# EAGLE design Mainboard (EAGLE 7.7.0)
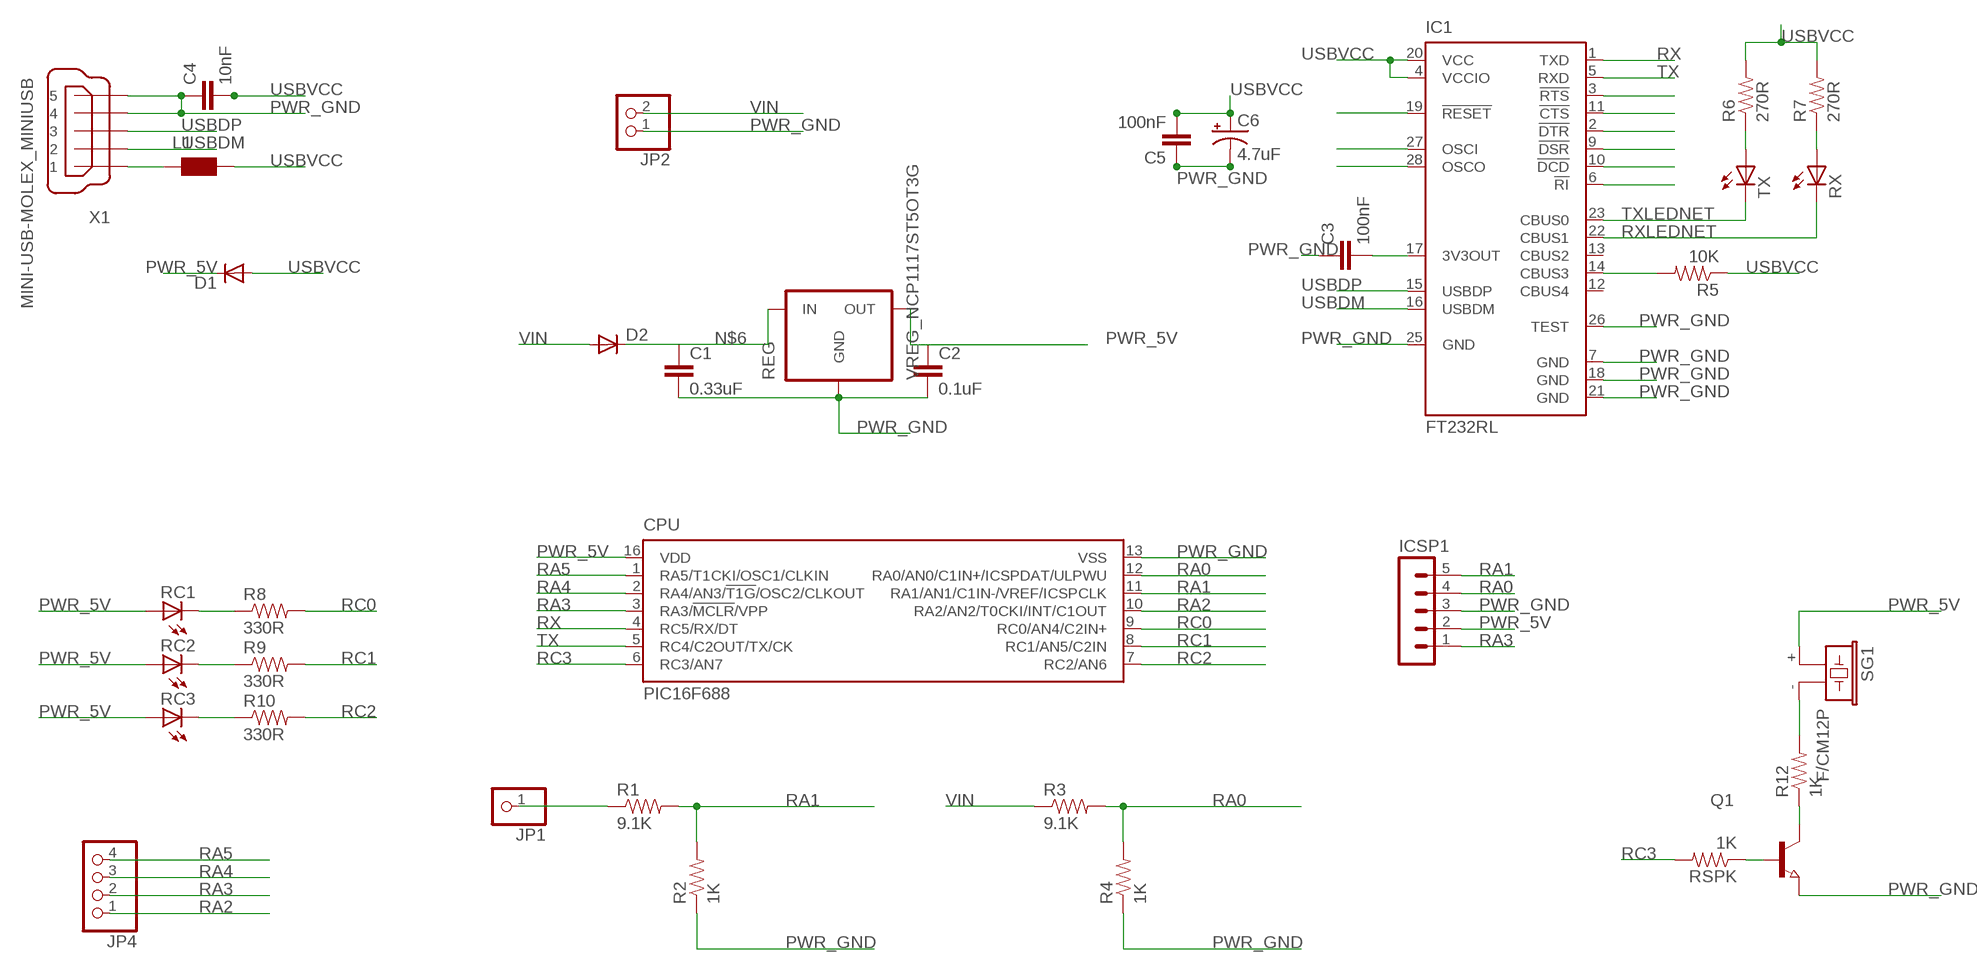
[diagram p0: schematic, sheet 1]

## Parts
C1  0.33uF  CAP0805  [0805]
C2  0.1uF  CAP0805  [0805]
C3  100nF  CAP0805  [0805]
C4  10nF  CAP0805  [0805]
C5  100nF  CAP0805  [0805]
C6  4.7uF  CAP_POL3528  [EIA3528]
CPU  PIC16F688  [QFN16-4X4]
D1  DIODESMA  [SMA-DIODE]
D2  DIODESMA  [SMA-DIODE]
IC1  FT232RL  [SSOP28]
ICSP1  MA05-1  [MA05-1]
JP1  PINHD-1X1  [1X01]
JP2  PINHD-1X2  [1X02]
JP4  PINHD-1X4  [1X04]
L1  WE-CBF_0805  [0805]
Q1  NPN-TRANSISTOR_SOT23  [SOT23]
R1  9.1K  RESISTOR  [0805]
R2  1K  RESISTOR  [0805]
R3  9.1K  RESISTOR  [0805]
R4  1K  RESISTOR  [0805]
R5  10K  RESISTOR  [0805]
R6  270R  RESISTOR  [0805]
R7  270R  RESISTOR  [0805]
R8  330R  RESISTOR  [0805]
R9  330R  RESISTOR  [0805]
R10  330R  RESISTOR  [0805]
R12  1K  RESISTOR  [0805]
RC1  LED0603  [LED-0603]
RC2  LED0603  [LED-0603]
RC3  LED0603  [LED-0603]
REG  VREG_NCP1117ST5OT3G  [SOT233]
RSPK  1K  RESISTOR  [0805]
RX  LED0603  [LED-0603]
SG1  F/CM12P  [F/CM12P]
TX  LED0603  [LED-0603]
X1  MINI-USB-MOLEX_MINIUSB  [32005-201]

## Nets
N$1: R8.1 RC1.C
N$2: JP1.1 R1.1
N$3: R9.1 RC2.C
N$4: R10.1 RC3.C
N$5: R7.1 RX.A
N$6: C1.1 D2.C REG.3(IN)
N$7: C3.2 IC1.17(3V3OUT)
N$8: Q1.3(C) R12.1
N$9: Q1.1(B) RSPK.1
N$10: IC1.14(CBUS3) R5.2
N$11: IC1.3(!RTS)
N$12: IC1.11(!CTS)
N$13: IC1.2(!DTR)
N$14: IC1.9(!DSR)
N$15: IC1.10(!DCD)
N$16 [power wires]: L1.1 X1.1
N$17: IC1.6(!RI)
N$18: IC1.27(OSCI)
N$19: IC1.28(OSCO)
N$20: IC1.19(!RESET)
N$21: R12.2 SG1.-
PWR_5V [power wires]: C2.1 CPU.16(VDD) D1.C ICSP1.2 RC1.A RC2.A RC3.A REG.2(OUT) SG1.+
PWR_GND [power wires]: C1.2 C2.2 C3.1 C4.1 C5.1 C6.C(-) CPU.13(VSS) IC1.7(GND) IC1.18(GND) IC1.21(GND) IC1.25(GND) IC1.26(TEST) ICSP1.3 JP2.1 Q1.2(E) R2.1 R4.1 REG.1(GND) X1.4 X1.5
RA0: CPU.12(RA0/AN0/C1IN+/ICSPDAT/ULPWU) ICSP1.4 R3.2 R4.2
RA1: CPU.11(RA1/AN1/C1IN-/VREF/ICSPCLK) ICSP1.5 R1.2 R2.2
RA2: CPU.10(RA2/AN2/T0CKI/INT/C1OUT) JP4.1
RA3: CPU.3(RA3/!MCLR!/VPP) ICSP1.1 JP4.2
RA4: CPU.2(RA4/AN3/!T1G!/OSC2/CLKOUT) JP4.3
RA5: CPU.1(RA5/T1CKI/OSC1/CLKIN) JP4.4
RC0: CPU.9(RC0/AN4/C2IN+) R8.2
RC1: CPU.8(RC1/AN5/C2IN) R9.2
RC2: CPU.7(RC2/AN6) R10.2
RC3: CPU.6(RC3/AN7) RSPK.2
RX: CPU.4(RC5/RX/DT) IC1.1(TXD)
RXLEDNET: IC1.22(CBUS1) RX.C
TX: CPU.5(RC4/C2OUT/TX/CK) IC1.5(RXD)
TXLEDNET: IC1.23(CBUS0) TX.C
TXNET: R6.1 TX.A
USBDM: IC1.16(USBDM) X1.2
USBDP: IC1.15(USBDP) X1.3
USBVCC [power wires]: C4.2 C5.2 C6.A(+) D1.A IC1.4(VCCIO) IC1.20(VCC) L1.2 R5.1 R6.2 R7.2
VIN [power wires]: D2.A JP2.2 R3.1
Unconnected: CPU.EXP IC1.12(CBUS4) IC1.13(CBUS2)

## Library data of the parts
C1-C5 = SparkFun:CAP: Capacitor Standard 0603 ceramic capacitor, and 0.1" leaded capacitor.
C6 = SparkFun:CAP_POL: Capacitor Polarized These are standard SMD and PTH capacitors. Normally 10uF, 47uF, and 100uF in electrolytic and tantalum varieties. Always verify the external diameter of the through hole cap, it varies with capacity, voltage, and manufacturer. The EIA devices should be standard.
CPU = microchip:PIC16F688: 14-Pin Flash-Based, 8-Bit CMOS Microcontrollers with nanoWatt Technology Source: http://ww1.microchip.com/downloads/en/DeviceDoc/41203E.pdf
D1 D2 = SparkFun:DIODE: Diode These are standard reverse protection diodes and small signal diodes. SMA package can handle up to about 1A. SOD-323 can handle about 200mA. What the SOD-323 package when ordering, there are some mfgs out there that are 5-pin packages.
IC1 = ftdichip:FT232R: Source: http://www.ftdichip.com/Documents/DataSheets/DS_FT232R_v104.pdf
ICSP1 = con-lstb:MA05-1: PIN HEADER
JP1 = pinhead:PINHD-1X1: PIN HEADER
JP2 = pinhead:PINHD-1X2: PIN HEADER
JP4 = pinhead:PINHD-1X4: PIN HEADER
L1 = wuerth-elektronik:WE-CBF: SMD EMI Suppression Ferrite Beads - excellent anti-EMI properties - low DCR - impedances till 3000 ohms - rated current up to 6 A
Q1 = semicon-smd-ipc:NPN-TRANSISTOR_: NPN TRANSISTOR
R1-R10 R12 RSPK = SparkFun:RESISTOR: Resistor Basic schematic elements and footprints for 0603, 1206, and PTH 1/10th watt (small) resistors.
RC1-RC3 RX TX = SparkFun:LED: LEDs Standard schematic elements and footprints for 5mm, 3mm, 1206, and 0603 sized LEDs. 5mm - Spark Fun Electronics SKU : COM-00529 (and others)
REG = Boobie:VREG_NCP1117ST5OT3G
SG1 = buzzer:F/CM12P: BUZZER Source: Buerklin; OC_FARNELL: unknown; OC_NEWARK: unknown
X1 = Boobie:MINI-USB-: MINI USB-B Conector Source: www.cypressindustries.com; OC_FARNELL: unknown; OC_NEWARK: unknown

## Net classes
0 default: width 0.25 mm
1 power wires: width 0.4 mm

## Board
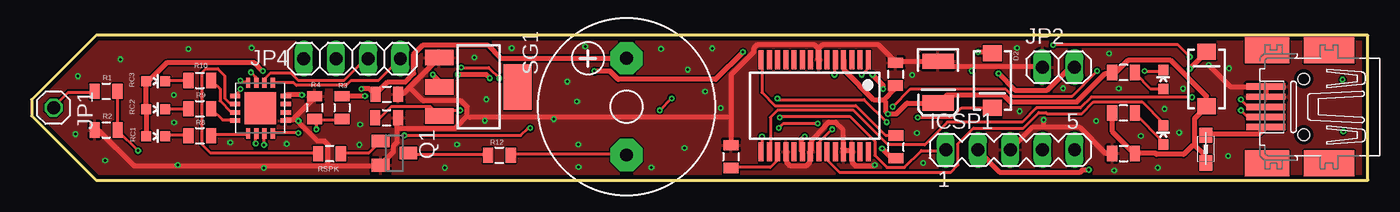
[diagram p1: board, top side]
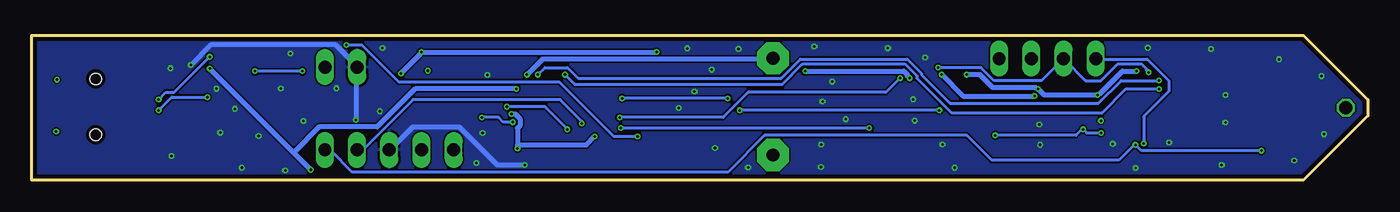
[diagram p2: board, bottom side, seen from below]

Size 105.41 x 11.43 mm. Coordinates in mm from the lower left corner, seen from the top.
Outline: 105.41,0 105.41,11.43 5.08,11.43 0,6.35 0,5.08 5.08,0 105.41,0
Copper layers (1*16): Top 0.035mm / dielectric 1.5mm / Bottom 0.035mm
Design rules "PCB-POOL HighSpec *": minimum track width 0.125mm, minimum drill 0.2mm, track to track 0.125mm, track to pad 0.125mm, pad to pad 0.125mm, via to via 0.125mm, smd to smd 0.125mm, copper to edge 0.3mm, drill to drill 0.2mm, minimum pad ring 0.2mm, minimum via ring 0.125mm, stop-mask expansion 0.02mm, vias tented up to drill 0.5mm, thermal gap 0.2mm

### Footprints (pad centres in the part's own frame; a part is rotated, then mirrored left to right if it is on the bottom)
0805 = smd 0.8 x 1.2: 1 -0.9,0; 2 0.9,0
EIA3528 = smd 1.2 x 2.5: A 1.65,0; C -1.65,0
QFN16-4X4 = smd 0.8 x 0.35: 1 -2,0.975; 2 -2,0.325; 3 -2,-0.325; 4 -2,-0.975; 9 2,-0.975; 10 2,-0.325; 11 2,0.325; 12 2,0.975 | smd 0.35 x 0.8: 5 -0.975,-2; 6 -0.325,-2; 7 0.325,-2; 8 0.975,-2; 13 0.975,2; 14 0.325,2; 15 -0.325,2; 16 -0.975,2 | smd 2.5 x 2.5: EXP 0,0
SMA-DIODE = smd 1.27 x 1.47: A -2.15,0; C 2.15,0
SSOP28 = smd 0.4 x 1.5: 1 -4.225,-3.625; 2 -3.575,-3.625; 3 -2.925,-3.625; 4 -2.275,-3.625; 5 -1.625,-3.625; 6 -0.975,-3.625; 7 -0.325,-3.625; 8 0.325,-3.625; 9 0.975,-3.625; 10 1.625,-3.625; 11 2.275,-3.625; 12 2.925,-3.625; 13 3.575,-3.625; 14 4.225,-3.625; 15 4.225,3.625; 16 3.575,3.625; 17 2.925,3.625; 18 2.275,3.625; 19 1.625,3.625; 20 0.975,3.625; 21 0.325,3.625; 22 -0.325,3.625; 23 -0.975,3.625; 24 -1.625,3.625; 25 -2.275,3.625; 26 -2.925,3.625; 27 -3.575,3.625; 28 -4.225,3.625
MA05-1 = drill 1.016 long: 1 -5.08,0; 2 -2.54,0; 3 0,0; 4 2.54,0; 5 5.08,0
1X01 = drill 1.016 octagon: 1 0,0
1X02 = drill 1.016 long: 1 -1.27,0; 2 1.27,0
1X04 = drill 1.016 long: 1 -3.81,0; 2 -1.27,0; 3 1.27,0; 4 3.81,0
0805' = smd 1.2 x 1: 1 -1.1,0; 2 1.1,0
SOT23 = smd 1 x 1.4: 1 -0.95,-1.1; 2 0.95,-1.1; 3 0,1.1
LED-0603 = smd 0.8 x 0.8: A 0,-0.75; C 0,0.75
SOT233 = smd 1.219 x 2.235: 1 -2.311,-3.099; 2 0,-3.099; 3 2.311,-3.099 | smd 3.6 x 2.2: 4 0,3.099
F/CM12P = drill 1.016 pad 2.54 octagon: + 3.81,0; - -3.81,0
32005-201 = smd 3.1 x 0.5: 1 3,1.6; 2 3,0.8; 3 3,0; 4 3,-0.8; 5 3,-1.6 | smd 4 x 2.05: M1 -2,-4.45; M2 -2,4.45 | smd 3.5 x 2.05: M3 2.9,4.45; M4 2.9,-4.45 | hole 0.9: 0,2.2; 0,-2.2

### Placement (x,y rotation side)
C1  28,4.93 0 top
C2  28.02,6.77 0 top
C3  55.17,1.86 270 top
C4  86.14,2.11 0 top
C5  68.15,8.36 270 top
C6  71.51,7.74 270 top
CPU  18.05,5.68 270 top
D1  92.69,7.97 90 top
D2  75.8,7.86 270 top
IC1  61.78,5.88 180 top
ICSP1  77.2,2.39 0 top
JP1  1.73,5.71 270 top
JP2  81,8.92 0 top
JP4  25.27,9.59 0 top
L1  [0805']  92.63,2.45 270 top
Q1  28.62,2.13 270 top
R1  5.87,7.01 0 top
R2  5.88,3.96 0 top
R3  24.48,5.72 270 top
R4  22.32,5.73 270 top
R5  68.18,2.62 90 top
R6  86.14,5.31 180 top
R7  86.14,8.49 180 top
R8  13.27,3.5 0 top
R9  13.27,5.64 0 top
R10  13.27,7.86 0 top
R12  36.9,1.97 0 top
RC1  9.77,3.47 270 top
RC2  9.77,5.59 270 top
RC3  9.77,7.81 270 top
REG  35.25,7.36 270 top
RSPK  23.5,2.09 180 top
RX  89.27,7.95 0 top
SG1  46.93,5.8 90 top
TX  89.27,3.56 0 top
X1  100.36,5.78 180 top

### Tracks (layer width: path | path; a pad name or v marks a point on that pad's centre or on a via)
N$1
  Top 0.25: RC1.C 10.55,3.54 12.33,3.54 R8.1
N$2
  Top 0.25: R1.1 4.93,6.92 2.86,6.92 1.74,5.79 JP1.1
N$3
  Top 0.25: RC2.C 10.55,5.6 12.33,5.6 R9.1
N$4
  Top 0.25: RC3.C 10.55,7.85 12.33,7.85 R10.1
N$5
  Top 0.25: RX.A 89.21,7.2 88.27,7.2 87.05,8.42 R7.1
N$6  (via drill 0.2)
  Top 0.25: C1.1 27.14,4.95 27.52,4.95 28.36,5.79 31.46,5.79 32.11,5.14 REG.3 32.21,5.23 32.49,5.51 v33.8,5.51 | v69.89,4.95 72.61,4.95 73.36,5.7 75.71,5.7 D2.C | v67.46,4.57 65.68,6.35 58.93,6.35 v58.83,6.45 | v49.55,5.51 v50.49,6.45
  Bottom 0.25: v69.89,4.95 68.58,4.95 68.21,4.57 v67.46,4.57 | v50.49,6.45 v58.83,6.45 | v33.8,5.51 v49.55,5.51
N$7
  Top 0.25: C3.2 55.18,1.01 58.27,1.01 58.83,1.57 58.83,2.23 IC1.17
N$8
  Top 0.25: R12.1 35.96,2.04 29.77,2.04 Q1.3
N$9
  Top 0.25: RSPK.1 24.43,2.14 26.58,2.14 Q1.1
N$10
  Top 0.25: R5.2 68.11,3.54 67.36,3.54 65.02,5.89 58.65,5.89 57.61,6.92 57.61,9.45 IC1.14
N$16
  Top 0.4: L1.1 92.68,3.64 96.8,3.64 97.27,4.1 X1.1
N$21
  Top 0.25: R12.2 37.83,2.04 46.93,2.04 SG1.-
N$22  (via drill 0.2)
  other vias: 103.43,7.93
N$23  (via drill 0.2)
  other vias: 103.48,3.84
N$34  (via drill 0.2)
  other vias: 74.16,8.63
N$60  (via drill 0.2)
  other vias: 21.05,4.69
PWR_5V  (via drill 0.2)
  Top 0.4: v91.36,8.79 92.68,10.1 D1.C | v83.39,0.82 82.93,0.82 82.74,0.64 76.36,0.64 74.68,2.32 ICSP1.2 | RC1.A 9.05,3.54 9.05,5.51 RC2.A 9.05,5.79 9.05,7.76 RC3.A 9.24,7.85 10.64,9.26 17.58,9.26 v18.24,8.6 | v21.33,6.73 20.11,6.73 CPU.16 | v26.02,7.2 26.68,7.2 27.05,6.82 C2.1 27.24,6.92 28.08,7.76 29.49,7.76 30.14,8.42 30.14,9.92 30.89,10.67 33.43,10.67 | v31.64,8.32 32.11,7.85 32.11,7.39 REG.2 | 46.93,9.64 SG1.+ | v67.18,7.2 67.18,7.48 v66.33,8.32
  Top 0.406: 33.43,10.67 35.96,10.67 36.99,9.63 46.91,9.63 SG1.+
  Bottom 0.4: v83.39,0.82 84.75,2.18 | 84.75,2.18 v91.36,8.79 | v31.64,8.32 30.61,8.32 29.58,7.29 26.21,7.29 v26.02,7.2 25.55,6.73 v21.33,6.73 21.14,6.82 19.36,8.6 v18.24,8.6 | 84.75,2.18 82.74,4.2 78.14,4.2 75.14,7.2 v67.18,7.2 | v66.33,8.32 65.11,9.54 47.02,9.54 SG1.+
PWR_GND  (via drill 0.2)
  Top 0.4: 29.82,7.34 32.11,9.64 REG.1 | 29.82,7.34 29.3,6.82 28.93,6.82 C2.2 | 20.72,4.9 22.36,6.54 R4.1 | 20.72,4.9 20.58,4.76 20.11,4.76 CPU.13 | 23.39,1.1 27.52,1.1 Q1.2 27.61,1.29 28.55,2.23 28.55,2.7 28.83,2.98 28.83,4.1 | 23.39,1.1 8.11,1.1 5.3,3.92 5.02,3.92 R2.1 | 28.83,4.1 28.83,4.85 C1.2 | 20.72,4.9 22.55,3.07 23.11,3.07 23.39,2.79 23.39,1.1 | 29.82,7.34 30.89,6.26 33.9,6.26 34.36,5.79 34.36,5.04 | 34.36,5.04 33.43,4.1 28.83,4.1 | IC1.18 59.58,2.23 59.58,1.39 59.86,1.1 61.08,1.1 61.36,1.39 61.36,2.23 IC1.21 61.55,2.42 61.55,3.17 62.58,4.2 62.58,4.29 62.86,4.57 63.43,4.57 63.99,4.01 63.99,2.51 IC1.25 64.08,2.32 64.64,2.32 IC1.26 64.74,2.14 64.74,1.39 65.02,1.1 66.43,1.1 v66.52,1.2 | 79.83,4.2 78.99,4.2 77.21,2.42 ICSP1.3 | 79.83,4.2 82.64,4.2 84.71,2.14 85.18,2.14 C4.1 | 55.18,4.95 55.18,8.32 56.96,10.1 56.96,10.39 57.24,10.67 61.74,10.67 62.02,10.39 | 55.18,4.95 55.18,2.79 C3.1 | 62.02,10.39 62.02,9.54 IC1.7 | X1.4 97.36,6.64 97.36,7.29 X1.5 97.18,7.39 94.55,7.39 v92.86,9.07 | JP2.1 79.64,8.98 71.96,8.98 71.68,9.26 C6.C 71.49,9.35 68.21,9.35 C5.1 68.02,9.45 66.8,10.67 62.4,10.67 62.21,10.48 62.02,10.39 | v79.83,4.76 79.83,4.2 | 55.18,4.95 34.55,4.95 34.36,5.04
  Bottom 0.4: v66.52,1.2 68.68,1.2 71.68,4.2 75.33,4.2 77.11,2.42 ICSP1.3 | v92.86,9.07 91.27,10.67 81.43,10.67 79.74,8.98 JP2.1 79.83,8.79 v79.83,4.76
  other vias: 34.92,9.68 37.87,10.41 43.66,10.54 12.36,10.36 17.35,10.44 7.01,9.54 3.66,8.2 3.45,3.63 5.8,1.55 11.52,1.21 11.24,4.56 11.22,6.72 18.32,0.97 20.12,2.87 25.91,4.39 25.85,2.8 33.56,2.82 32.6,0.98 35.76,4.69 35.88,6.38 41.18,4.81 43.02,6.2 42.26,7.77 43.13,2.82 43.14,1.04 48.89,0.99 49.65,10.36 53.69,10.4 51.75,8.72 51.5,2.54 69.46,8.3 69.84,3.72 70.33,1.36 77.73,10.42 84.99,10 85.77,7.23 87.5,3.49 90.54,3.75 94.46,8.82 94.38,1.9 88.84,0.98 85.41,0.77 83.98,4.68 15.67,2.97 53.12,6.99 54.37,5.69 77.95,5.44 89.38,5.63 90.85,7.22 81.37,7.25
  pour Bottom: 108.07,17.39 108.07,-12.59 -3.68,-12.59 -3.68,17.04
  pour Top: -1.4,27.35 -1.4,-7.04 113.08,-7.04 113.08,28.11
RA0  (via drill 0.2)
  Top 0.25: v21.05,3.73 19.08,3.73 CPU.12 | v22.46,4.01 22.46,4.67 22.36,4.76 R4.2 22.46,4.76 24.43,4.76 R3.2 | v62.02,4.48 59.3,4.48 v58.93,4.1 | v39.33,4.1 39.15,4.1 38.58,3.54 v29.39,3.54
  Bottom 0.25: v21.05,3.73 22.18,3.73 v22.46,4.01 22.55,4.01 23.02,3.54 v29.39,3.54 | v62.02,4.48 62.02,4.67 63.71,6.35 75.33,6.35 79.27,2.42 79.64,2.42 ICSP1.4 | v39.33,4.1 v58.93,4.1
RA1  (via drill 0.2)
  Top 0.25: v18.33,2.79 18.33,3.64 CPU.11 | v8.39,2.32 6.8,3.92 R2.2 6.8,4.01 6.8,6.92 R1.2
  Bottom 0.25: v8.39,2.32 17.86,2.32 v18.33,2.79 18.43,2.79 19.64,1.57 29.68,1.57 31.64,3.54 47.58,3.54 50.49,0.64 80.11,0.64 81.8,2.32 82.27,2.32 ICSP1.5
RA2  (via drill 0.2)
  Top 0.25: v17.68,2.89 17.68,3.64 CPU.10
  Bottom 0.25: v17.68,2.89 17.68,5.04 15.71,7.01 15.71,7.85 17.39,9.54 21.43,9.54 JP4.1
RA3  (via drill 0.2)
  Top 0.25: v17.3,8.51 17.68,8.14 17.68,7.76 CPU.3 | v59.02,4.95 59.11,5.04 64.55,5.04 66.52,3.07 66.52,1.95 67.46,1.01 68.86,1.01 70.18,2.32 72.05,2.32 ICSP1.1 | v36.9,8.04 36.05,8.89 v33.9,8.89
  Bottom 0.25: v17.3,8.51 17.49,8.7 17.49,8.79 17.86,9.17 19.74,9.17 21.05,7.85 22.27,7.85 23.96,9.54 JP4.2 24.05,9.54 25.74,7.85 29.49,7.85 30.52,8.89 v33.9,8.89 | v59.02,4.95 50.86,4.95 48.9,6.92 38.02,6.92 v36.9,8.04
RA4
  Top 0.25: CPU.2 18.43,7.76 18.43,8.04 18.8,8.42 20.49,8.42 21.05,7.85 24.61,7.85 26.3,9.54 26.49,9.54 JP4.3
RA5
  Top 0.25: CPU.1 19.08,7.67 20.68,7.67 20.86,7.48 24.8,7.48 25.18,7.85 27.33,7.85 29.02,9.54 JP4.4
RC0
  Top 0.25: CPU.9 17.02,3.64 14.3,3.64 14.21,3.54 R8.2
RC1
  Top 0.25: CPU.8 15.99,4.76 15.05,4.76 14.21,5.6 R9.2
RC2
  Top 0.25: CPU.7 15.99,5.42 15.71,5.42 14.86,6.26 14.86,7.2 14.21,7.85 R10.2
RC3
  Top 0.25: CPU.6 15.99,6.07 15.61,6.07 15.24,6.45 15.24,8.23 14.68,8.79 13.74,8.79 13.46,8.51 13.46,2.79 14.11,2.14 22.55,2.14 RSPK.2
RX  (via drill 0.2)
  Top 0.25: v16.46,7.85 16.55,7.76 17.02,7.76 CPU.4 | v65.49,8.32 65.96,8.79 65.96,9.45 IC1.1
  Bottom 0.25: v16.46,7.85 19.46,7.85 21.24,6.07 32.96,6.07 35.21,8.32 35.21,8.42 36.33,9.54 44.77,9.54 46.27,8.04 62.3,8.04 63.15,8.89 64.93,8.89 v65.49,8.32
RXLEDNET  (via drill 0.2)
  Top 0.25: v87.8,8.6 89.21,8.6 RX.C | v84.05,8.6 82.08,6.64 77.39,6.64 76.83,7.2 69.33,7.2 v67.93,5.79 | v63.15,4.01 62.11,2.98 62.11,2.32 IC1.22
  Bottom 0.25: v84.05,8.6 v87.8,8.6 | v67.93,5.79 64.93,5.79 v63.15,4.01
TX  (via drill 0.2)
  Top 0.25: v16.46,7.2 16.46,7.1 16.08,6.73 CPU.5 | v63.33,8.32 63.33,9.45 IC1.5
  Bottom 0.25: v16.46,7.2 19.08,7.2 20.96,5.32 32.86,5.32 35.58,8.04 35.58,8.23 36.52,9.17 44.58,9.17 46.18,7.57 62.58,7.57 v63.33,8.32
TXLEDNET
  Top 0.25: TX.C 89.21,4.39 89.21,4.57 87.61,6.17 83.77,6.17 82.83,5.23 80.11,5.23 80.02,5.32 79.46,5.32 78.24,4.1 74.3,4.1 73.08,2.89 73.08,1.2 72.52,0.64 63.71,0.64 62.77,1.57 62.77,2.23 IC1.23
TXNET
  Top 0.25: TX.A 89.21,2.89 89.21,3.07 87.05,5.23 R6.1
USBDM  (via drill 0.2)
  Top 0.25: v91.55,6.54 83.58,6.54 82.74,5.7 79.27,5.7 78.14,4.57 72.24,4.57 70.46,2.79 67.55,2.79 64.83,5.51 58.83,5.51 58.27,4.95 58.27,2.32 IC1.16 | v95.39,5.51 95.86,5.04 97.27,5.04 X1.2
  Bottom 0.25: v91.55,6.54 94.36,6.54 v95.39,5.51
USBDP  (via drill 0.2)
  Top 0.25: v57.61,3.45 57.61,2.32 IC1.15 | v80.58,10.67 90.43,10.67 v91.36,9.73 | v95.39,6.35 95.96,5.79 97.27,5.79 X1.3
  Bottom 0.25: v57.61,3.45 59.49,3.45 63.8,7.76 76.46,7.76 79.36,10.67 v80.58,10.67 | v91.36,9.73 94.18,6.92 94.83,6.92 v95.39,6.35
USBVCC  (via drill 0.2)
  Top 0.4: R6.2 85.27,5.23 85.27,3.82 86.96,2.14 C4.2 87.24,2.14 88.64,2.14 88.74,2.04 90.89,2.04 91.55,2.7 91.74,2.79 | 91.74,2.79 92.58,1.95 92.58,1.39 L1.2 | 91.74,2.79 91.74,4.85 92.58,5.7 D1.A 92.68,5.89 92.68,6.64 89.86,9.45 86.49,9.45 85.55,8.51 85.27,8.51 R7.2 85.08,8.42 84.71,8.42 82.46,6.17 77.21,6.17 76.64,6.73 72.24,6.73 71.68,6.17 C6.A 71.49,6.07 69.05,6.07 68.21,5.23 v67.55,5.23 67.36,5.42 67.36,6.17 67.27,6.35 | 67.27,6.35 68.11,7.2 68.11,7.39 C5.2 | 67.27,6.35 66.43,6.35 64.08,8.7 64.08,9.45 IC1.4 | v67.08,2.51 67.83,1.76 68.11,1.76 R5.1 | v60.99,3.45 60.71,3.17 60.71,2.32 60.8,2.23 IC1.20
  Bottom 0.4: 67.08,2.79 67.08,4.1 66.89,4.29 66.89,4.85 67.27,5.23 v67.55,5.23 | 67.08,2.79 v67.08,2.51 | v60.99,3.45 61.65,2.79 67.08,2.79
VIN  (via drill 0.2)
  Top 0.4: v26.3,6.64 24.52,6.64 R3.1 | v33.61,8.32 35.86,8.32 v36.15,8.04 | v44.4,8.6 45.61,8.6 46.27,7.95 53.96,7.95 v56.11,10.1 | v74.68,10.1 75.61,10.1 75.71,10.01 D2.A | v76.27,8.42 77.58,7.1 80.11,7.1 81.89,8.89 82.27,8.89 JP2.2
  Bottom 0.4: v26.3,6.64 31.93,6.64 v33.61,8.32 | v36.15,8.04 36.33,8.23 36.33,8.32 36.61,8.6 v44.4,8.6 | v56.11,10.1 v74.68,10.1 74.77,9.92 v76.27,8.42